# EAGLE board Protein (EAGLE 6.3), part 1 of 2
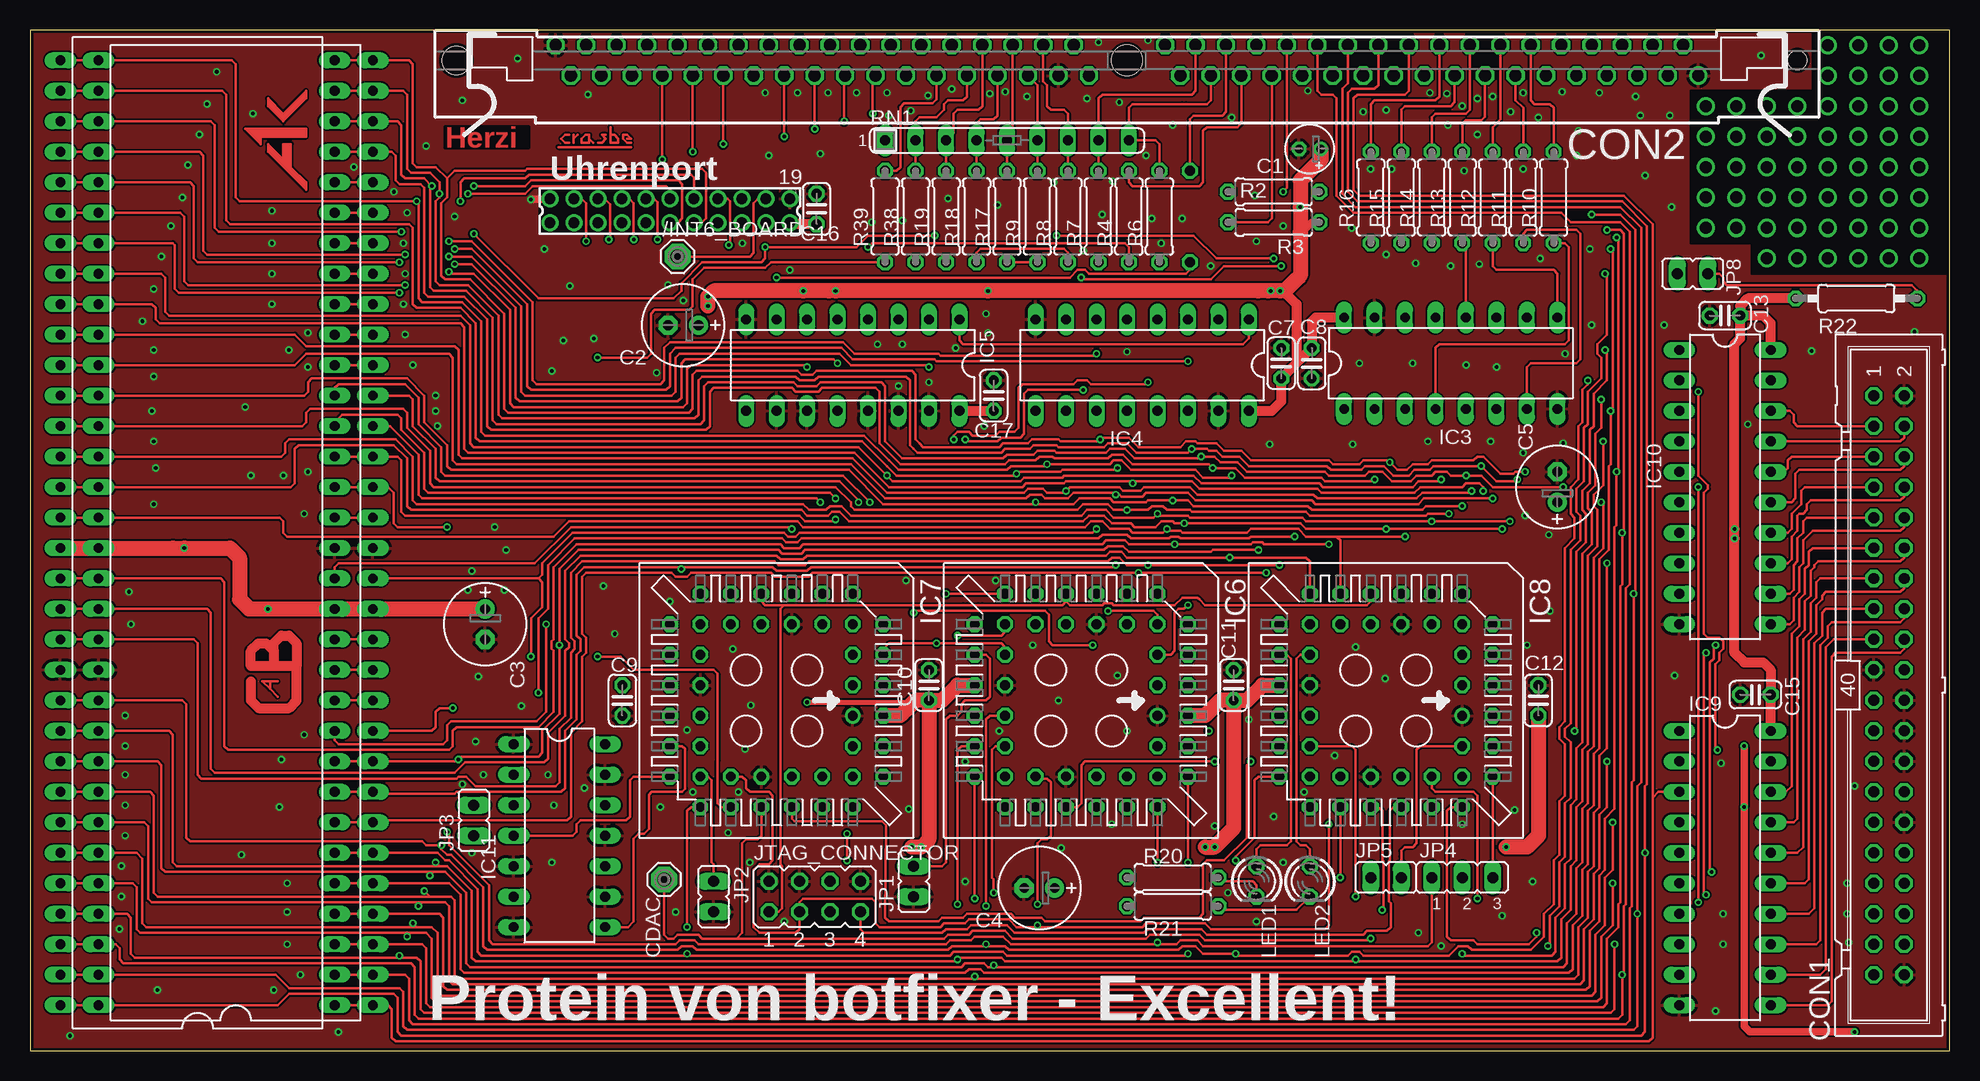
[diagram p6: board, top side]
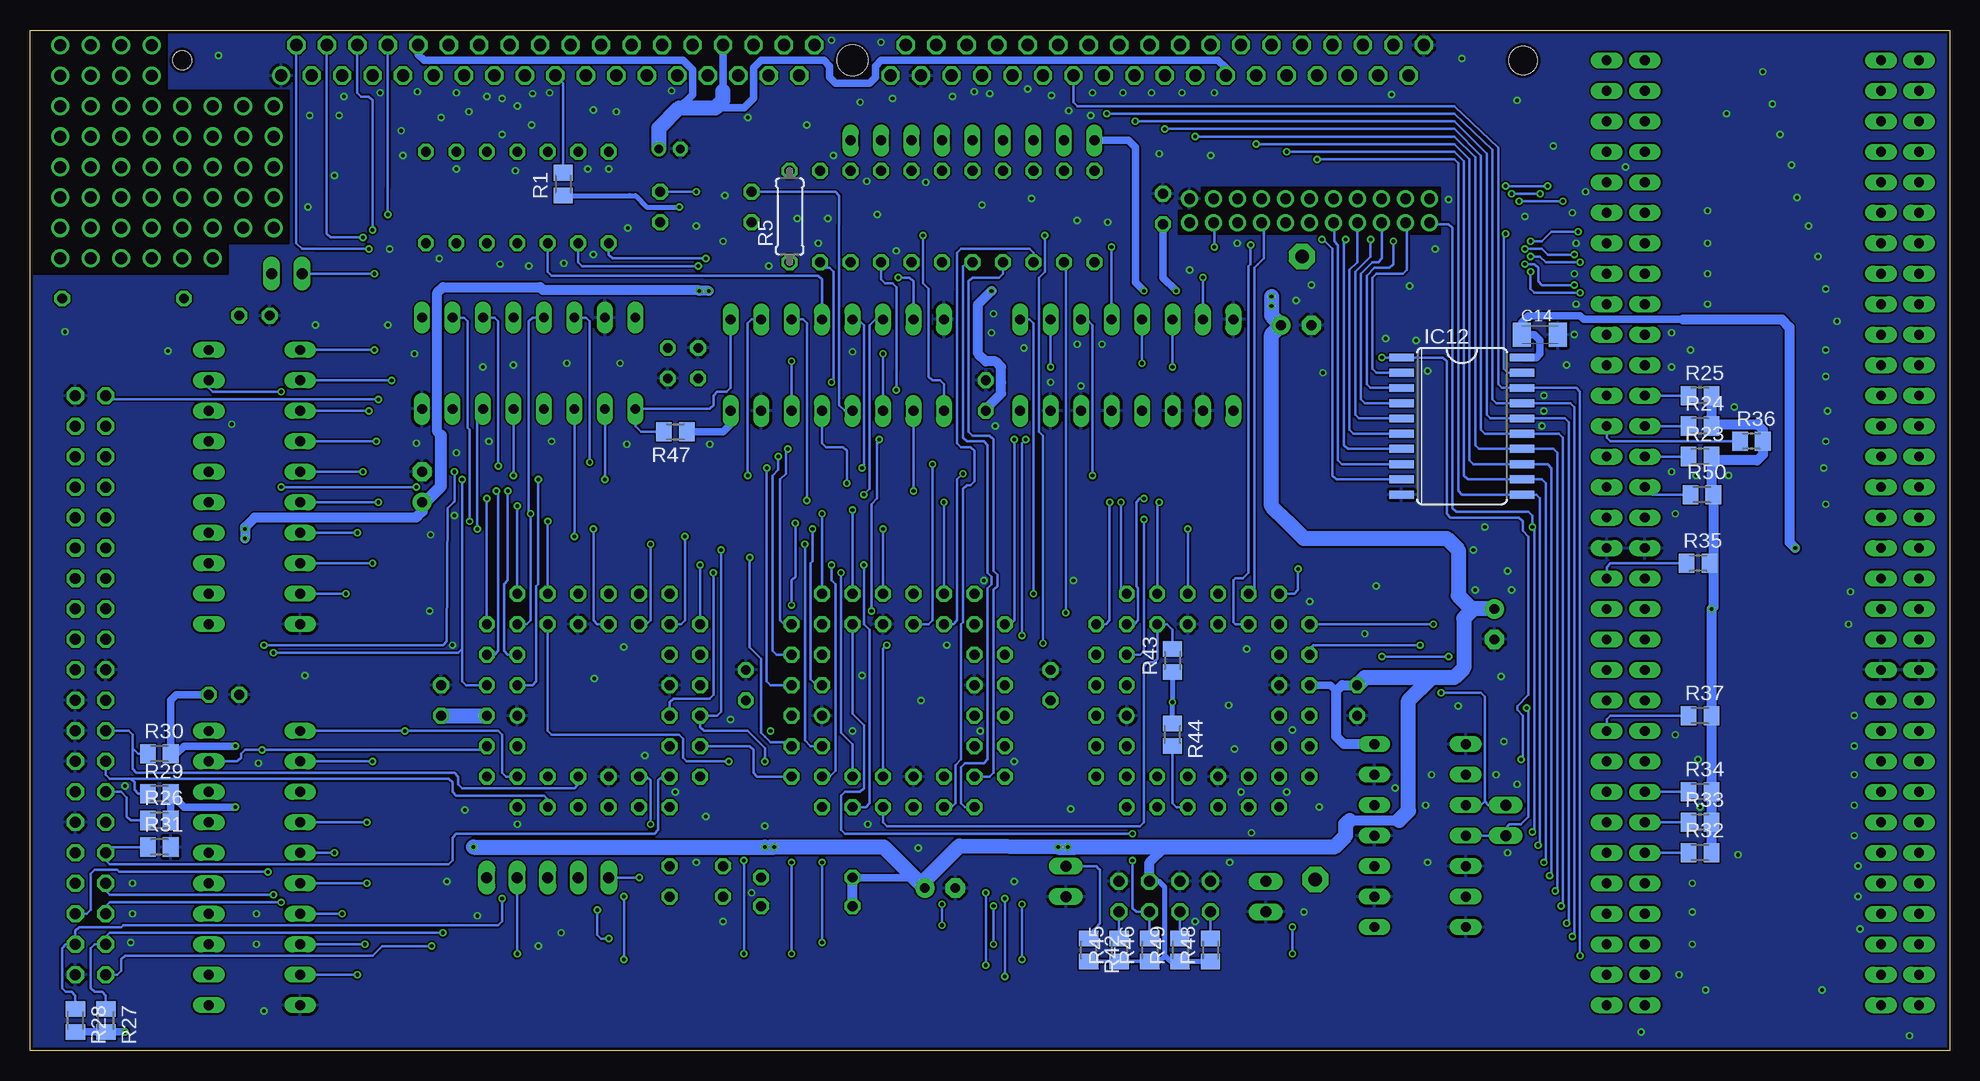
[diagram p7: board, bottom side, seen from below]

Size 160 x 85.08 mm. Coordinates in mm from the lower left corner, seen from the top.
Outline: 0,0 160,0 160,85.08 0,85.08 0,0
Copper layers (1*16): Top 0.035mm / dielectric 1.5mm / Bottom 0.035mm
Design rules "Fusion_eagle_rule_v1.1": minimum track width 6mil, minimum drill 12mil, track to track 6mil, track to pad 6mil, pad to pad 6mil, via to via 6mil, smd to smd 0mil, copper to edge 10mil, drill to drill 10mil, minimum pad ring 10mil, minimum via ring 6mil, stop-mask expansion 2mil, vias tented up to drill 100mil, thermal gap 10mil

## Footprints (pad centres in the part's own frame; a part is rotated, then mirrored left to right if it is on the bottom)
SE11 = drill 1.118 pad 2.159 octagon: MP 0,0
E1,8-4 = drill 0.711 pad 1.168: + -0.889,0 | drill 0.711 pad 1.168 octagon: - 0.889,0
E2,5-7 = drill 0.813 pad 1.6: + -1.27,0 | drill 0.813 pad 1.6 octagon: - 1.27,0
C025-024X044 = drill 0.813 octagon: 1 -1.27,0; 2 1.27,0
C1206K = smd 1.5 x 2: 1 -1.5,0; 2 1.5,0
ML40 = drill 0.914 octagon: 1 -24.13,-1.27; 2 -24.13,1.27; 3 -21.59,-1.27; 4 -21.59,1.27; 5 -19.05,-1.27; 6 -19.05,1.27; 7 -16.51,-1.27; 8 -16.51,1.27; 9 -13.97,-1.27; 10 -13.97,1.27; 11 -11.43,-1.27; 12 -11.43,1.27; 13 -8.89,-1.27; 14 -8.89,1.27; 15 -6.35,-1.27; 16 -6.35,1.27; 17 -3.81,-1.27; 18 -3.81,1.27; 19 -1.27,-1.27; 20 -1.27,1.27; 21 1.27,-1.27; 22 1.27,1.27; 23 3.81,-1.27; 24 3.81,1.27; 25 6.35,-1.27; 26 6.35,1.27; 27 8.89,-1.27; 28 8.89,1.27; 29 11.43,-1.27; 30 11.43,1.27; 31 13.97,-1.27; 32 13.97,1.27; 33 16.51,-1.27; 34 16.51,1.27; 35 19.05,-1.27; 36 19.05,1.27; 37 21.59,-1.27; 38 21.59,1.27; 39 24.13,-1.27; 40 24.13,1.27
73826962 = drill 1.016: 1 47.625,-1.27 | drill 1.016 octagon: 2 46.355,1.27; 3 45.085,-1.27; 4 43.815,1.27; 5 42.545,-1.27; 6 41.275,1.27; 7 40.005,-1.27; 8 38.735,1.27; 9 37.465,-1.27; 10 36.195,1.27; 11 34.925,-1.27; 12 33.655,1.27; 13 32.385,-1.27; 14 31.115,1.27; 15 29.845,-1.27; 16 28.575,1.27; 17 27.305,-1.27; 18 26.035,1.27; 19 24.765,-1.27; 20 23.495,1.27; 21 22.225,-1.27; 22 20.955,1.27; 23 19.685,-1.27; 24 18.415,1.27; 25 17.145,-1.27; 26 15.875,1.27; 27 14.605,-1.27; 28 13.335,1.27; 29 12.065,-1.27; 30 10.795,1.27; 31 9.525,-1.27; 32 8.255,1.27; 33 6.985,-1.27; 34 5.715,1.27; 35 4.445,-1.27; 36 3.175,1.27; 37 -3.175,-1.27; 38 -4.445,1.27; 39 -5.715,-1.27; 40 -6.985,1.27; 41 -8.255,-1.27; 42 -9.525,1.27; 43 -10.795,-1.27; 44 -12.065,1.27; 45 -13.335,-1.27; 46 -14.605,1.27; 47 -15.875,-1.27; 48 -17.145,1.27; 49 -18.415,-1.27; 50 -19.685,1.27; 51 -20.955,-1.27; 52 -22.225,1.27; 53 -23.495,-1.27; 54 -24.765,1.27; 55 -26.035,-1.27; 56 -27.305,1.27; 57 -28.575,-1.27; 58 -29.845,1.27; 59 -31.115,-1.27; 60 -32.385,1.27; 61 -33.655,-1.27; 62 -34.925,1.27; 63 -36.195,-1.27; 64 -37.465,1.27; 65 -38.735,-1.27; 66 -40.005,1.27; 67 -41.275,-1.27; 68 -42.545,1.27; 69 -43.815,-1.27; 70 -45.085,1.27; 71 -46.355,-1.27; 72 -47.625,1.27 | hole 2.362: -55.88,0 | hole 1.575: 55.88,0 | hole 2.54: 0,0
DIL64 = drill 0.813 long: 1 -39.37,-11.43; 2 -36.83,-11.43; 3 -34.29,-11.43; 4 -31.75,-11.43; 5 -29.21,-11.43; 6 -26.67,-11.43; 7 -24.13,-11.43; 8 -21.59,-11.43; 9 -19.05,-11.43; 10 -16.51,-11.43; 11 -13.97,-11.43; 12 -11.43,-11.43; 13 -8.89,-11.43; 14 -6.35,-11.43; 15 -3.81,-11.43; 16 -1.27,-11.43; 17 1.27,-11.43; 18 3.81,-11.43; 19 6.35,-11.43; 20 8.89,-11.43; 21 11.43,-11.43; 22 13.97,-11.43; 23 16.51,-11.43; 24 19.05,-11.43; 25 21.59,-11.43; 26 24.13,-11.43; 27 26.67,-11.43; 28 29.21,-11.43; 29 31.75,-11.43; 30 34.29,-11.43; 31 36.83,-11.43; 32 39.37,-11.43; 33 39.37,11.43; 34 36.83,11.43; 35 34.29,11.43; 36 31.75,11.43; 37 29.21,11.43; 38 26.67,11.43; 39 24.13,11.43; 40 21.59,11.43; 41 19.05,11.43; 42 16.51,11.43; 43 13.97,11.43; 44 11.43,11.43; 45 8.89,11.43; 46 6.35,11.43; 47 3.81,11.43; 48 1.27,11.43; 49 -1.27,11.43; 50 -3.81,11.43; 51 -6.35,11.43; 52 -8.89,11.43; 53 -11.43,11.43; 54 -13.97,11.43; 55 -16.51,11.43; 56 -19.05,11.43; 57 -21.59,11.43; 58 -24.13,11.43; 59 -26.67,11.43; 60 -29.21,11.43; 61 -31.75,11.43; 62 -34.29,11.43; 63 -36.83,11.43; 64 -39.37,11.43
DIL16 = drill 0.813 long: 1 -8.89,-3.81; 2 -6.35,-3.81; 3 -3.81,-3.81; 4 -1.27,-3.81; 5 1.27,-3.81; 6 3.81,-3.81; 7 6.35,-3.81; 8 8.89,-3.81; 9 8.89,3.81; 10 6.35,3.81; 11 3.81,3.81; 12 1.27,3.81; 13 -1.27,3.81; 14 -3.81,3.81; 15 -6.35,3.81; 16 -8.89,3.81
PLCC-S44 = drill 0.813: 1 1.27,6.35 | drill 0.813 octagon: 2 -1.27,8.89; 3 -1.27,6.35; 4 -3.81,8.89; 5 -3.81,6.35; 6 -6.35,8.89; 7 -8.89,6.35; 8 -6.35,6.35; 9 -8.89,3.81; 10 -6.35,3.81; 11 -8.89,1.27; 12 -6.35,1.27; 13 -8.89,-1.27; 14 -6.35,-1.27; 15 -8.89,-3.81; 16 -6.35,-3.81; 17 -8.89,-6.35; 18 -6.35,-8.89; 19 -6.35,-6.35; 20 -3.81,-8.89; 21 -3.81,-6.35; 22 -1.27,-8.89; 23 -1.27,-6.35; 24 1.27,-8.89; 25 1.27,-6.35; 26 3.81,-8.89; 27 3.81,-6.35; 28 6.35,-8.89; 29 8.89,-6.35; 30 6.35,-6.35; 31 8.89,-3.81; 32 6.35,-3.81; 33 8.89,-1.27; 34 6.35,-1.27; 35 8.89,1.27; 36 6.35,1.27; 37 8.89,3.81; 38 6.35,3.81; 39 8.89,6.35; 40 6.35,8.89; 41 6.35,6.35; 42 3.81,8.89; 43 3.81,6.35; 44 1.27,8.89
DIL20 = drill 0.813 long: 1 -11.43,-3.81; 2 -8.89,-3.81; 3 -6.35,-3.81; 4 -3.81,-3.81; 5 -1.27,-3.81; 6 1.27,-3.81; 7 3.81,-3.81; 8 6.35,-3.81; 9 8.89,-3.81; 10 11.43,-3.81; 11 11.43,3.81; 12 8.89,3.81; 13 6.35,3.81; 14 3.81,3.81; 15 1.27,3.81; 16 -1.27,3.81; 17 -3.81,3.81; 18 -6.35,3.81; 19 -8.89,3.81; 20 -11.43,3.81
DIL14 = drill 0.813 long: 1 -7.62,-3.81; 2 -5.08,-3.81; 3 -2.54,-3.81; 4 0,-3.81; 5 2.54,-3.81; 6 5.08,-3.81; 7 7.62,-3.81; 8 7.62,3.81; 9 5.08,3.81; 10 2.54,3.81; 11 0,3.81; 12 -2.54,3.81; 13 -5.08,3.81; 14 -7.62,3.81
SO20W = smd 0.66 x 2.032: 1 -5.715,-5.029; 2 -4.445,-5.029; 3 -3.175,-5.029; 4 -1.905,-5.029; 5 -0.635,-5.029; 6 0.635,-5.029; 7 1.905,-5.029; 8 3.175,-5.029; 9 4.445,-5.029; 10 5.715,-5.029; 11 5.715,5.029; 12 4.445,5.029; 13 3.175,5.029; 14 1.905,5.029; 15 0.635,5.029; 16 -0.635,5.029; 17 -1.905,5.029; 18 -3.175,5.029; 19 -4.445,5.029; 20 -5.715,5.029
JP1 = drill 0.914 long: 1 0,-1.27; 2 0,1.27
JP2 = drill 0.914 long: 1 -2.54,0; 2 0,0; 3 2.54,0
JP4Q = drill 0.914 octagon: 1 -3.81,-1.27; 2 -3.81,1.27; 3 -1.27,-1.27; 4 -1.27,1.27; 5 1.27,-1.27; 6 1.27,1.27; 7 3.81,-1.27; 8 3.81,1.27
LED3MM = drill 0.813 octagon: A -1.27,0; K 1.27,0
M0805 = smd 1.3 x 1.6: 1 -0.95,0; 2 0.95,0
0207/7 = drill 0.813 octagon: 1 -3.81,0; 2 3.81,0
0207/10 = drill 0.813 octagon: 1 -5.08,0; 2 5.08,0
SIL9 = drill 0.813 long: 1 -10.16,0; 2 -7.62,0; 3 -5.08,0; 4 -2.54,0; 5 0,0; 6 2.54,0; 7 5.08,0; 8 7.62,0; 9 10.16,0
BREAD = drill 1: P$1 0,0; P$2 0,2.54
87758-2216 = drill 0.9 pad 1.27: 1 -10,-1; 2 -10,1; 3 -8,-1; 4 -8,1; 5 -6,-1; 6 -6,1; 7 -4,-1; 8 -4,1; 9 -2,-1; 10 -2,1; 11 0,-1; 12 0,1; 13 2,-1; 14 2,1; 15 4,-1; 16 4,1; 17 6,-1; 18 6,1; 19 8,-1; 20 8,1; 21 10,-1; 22 10,1

## Placement (x,y rotation side)
/INT6_BOARD  SE11  [SE11]  53.98,66.2 0 top
C1  [E1,8-4]  106.68,75.17 180 top
C2  [E2,5-7]  54.45,60.48 180 top
C3  [E2,5-7]  37.94,35.56 270 top
C4  [E2,5-7]  84.14,13.57 180 top
C5  [E2,5-7]  127.32,46.99 90 top
C7  100n  [C025-024X044]  104.3,57.31 90 top
C8  100n  [C025-024X044]  106.84,57.31 270 top
C9  100n  [C025-024X044]  49.37,29.21 270 top
C10  100n  [C025-024X044]  74.93,30.48 90 top
C11  100n  [C025-024X044]  100.33,30.48 90 top
C12  100n  [C025-024X044]  125.73,29.21 90 top
C13  100n  [C025-024X044]  141.29,61.28 180 top
C14  100n  [C1206K]  34.13,59.69 0 bottom
C15  100n  [C025-024X044]  143.83,29.69 0 top
C16  100n  [C025-024X044]  65.56,70.17 90 top
C17  100n  [C025-024X044]  80.33,54.61 90 top
CDAC_BOARD  SE11  [SE11]  52.86,14.29 180 top
CON1  [ML40]  154.94,30.48 270 top
CON2  [73826962]  91.44,82.55 0 top
IC1  [DIL64]  17.14,43.18 90 top
IC2  [DIL64]  13.97,43.18 90 top
IC3  74157N  [DIL16]  118.43,57.31 0 top
IC4  74157N  [DIL16]  92.71,57.15 180 top
IC5  74157N  [DIL16]  68.58,57.15 180 top
IC6  M4A5_64/32  [PLCC-S44]  87.63,29.21 270 top
IC7  M4A5_64/32  [PLCC-S44]  62.23,29.21 270 top
IC8  M4A5_64/32  [PLCC-S44]  113.03,29.21 270 top
IC9  74LS245N  [DIL20]  141.29,15.24 270 top
IC10  74LS245N  [DIL20]  141.29,46.99 270 top
IC11  7407  [DIL14]  44.13,17.94 270 top
IC12  74LS245DW  [SO20W]  40.64,52.07 270 bottom
JP1  [JP1]  73.66,14.13 0 top
JP2  [JP1]  56.99,12.86 180 top
JP3  [JP1]  36.99,19.21 0 top
JP4  [JP2]  119.38,14.45 0 top
JP5  [JP1]  113.03,14.45 270 top
JP8  [JP1]  138.59,64.77 90 top
JTAG_CONNECTOR  [JP4Q]  65.41,12.86 0 top
LED1  [LED3MM]  102.23,14.13 270 top
LED2  [LED3MM]  106.68,14.13 270 top
R1  [M0805]  115.57,72.23 90 bottom
R2  [0207/7]  103.66,71.6 0 top
R3  [0207/7]  103.66,69.06 180 top
R4  [0207/7]  91.6,69.53 90 top
R5  [0207/7]  96.68,69.53 90 bottom
R6  [0207/7]  94.14,69.53 90 top
R7  [0207/7]  89.06,69.53 90 top
R8  [0207/7]  86.52,69.53 90 top
R9  [0207/7]  83.98,69.53 90 top
R10  [0207/7]  127,71.12 90 top
R11  [0207/7]  124.46,71.12 90 top
R12  [0207/7]  121.92,71.12 90 top
R13  [0207/7]  119.38,71.12 90 top
R14  [0207/7]  116.84,71.12 90 top
R15  [0207/7]  114.3,71.12 90 top
R16  [0207/7]  111.76,71.12 90 top
R17  [0207/7]  81.44,69.53 90 top
R18  [0207/7]  78.9,69.53 90 top
R19  [0207/7]  76.36,69.53 90 top
R20  470R  [0207/7]  95.25,14.45 180 top
R21  470R  [0207/7]  95.25,12.06 180 top
R22  4K7  [0207/10]  152.24,62.71 0 top
R23  [M0805]  20.8,49.53 0 bottom
R24  [M0805]  20.8,52.07 0 bottom
R25  [M0805]  20.8,54.61 0 bottom
R26  [M0805]  149.22,19.21 0 bottom
R27  [M0805]  153.67,2.54 270 bottom
R28  [M0805]  156.21,2.54 270 bottom
R29  [M0805]  149.22,21.43 0 bottom
R30  [M0805]  149.22,24.77 0 bottom
R31  [M0805]  149.22,16.99 0 bottom
R32  [M0805]  20.8,16.51 0 bottom
R33  [M0805]  20.8,19.05 0 bottom
R34  [M0805]  20.8,21.59 0 bottom
R35  [M0805]  20.95,40.64 0 bottom
R36  [M0805]  16.51,50.8 0 bottom
R37  [M0805]  20.8,27.94 0 bottom
R38  [0207/7]  73.82,69.53 90 top
R39  [0207/7]  71.28,69.53 90 top
R42  [M0805]  71.75,8.41 270 bottom
R43  [M0805]  64.77,32.54 90 bottom
R44  [M0805]  64.77,26.35 270 bottom
R45  [M0805]  69.22,8.41 90 bottom
R46  [M0805]  66.67,8.41 90 bottom
R47  [M0805]  106.2,51.59 180 bottom
R48  [M0805]  61.59,8.41 90 bottom
R49  [M0805]  64.14,8.41 90 bottom
R50  [M0805]  20.64,46.35 0 bottom
RN1  [SIL9]  81.44,75.88 0 top
U$1  A1K  [A1K]  21.11,76.2 90 top
U$2  CRASBE  [CRASBE]  47.15,76.2 0 top
U$3  CAB  [CAB-LOGO]  20,31.43 90 top
U$4  BREAD_2  [BREAD]  157.48,81.28 0 top
U$5  BREAD_2  [BREAD]  152.4,76.2 0 top
U$6  BREAD_2  [BREAD]  152.4,81.28 0 top
U$7  BREAD_2  [BREAD]  149.86,81.28 0 top
U$8  BREAD_2  [BREAD]  154.94,76.2 0 top
U$9  BREAD_2  [BREAD]  154.94,71.12 0 top
U$10  BREAD_2  [BREAD]  157.48,71.12 0 top
U$11  BREAD_2  [BREAD]  157.48,76.2 0 top
U$12  BREAD_2  [BREAD]  154.94,81.28 0 top
U$13  BREAD_2  [BREAD]  152.4,71.12 0 top
U$14  BREAD_2  [BREAD]  149.86,76.2 0 top
U$15  BREAD_2  [BREAD]  147.32,76.2 0 top
U$16  BREAD_2  [BREAD]  139.7,71.12 0 top
U$17  BREAD_2  [BREAD]  144.78,76.2 0 top
U$18  BREAD_2  [BREAD]  149.86,71.12 0 top
U$19  BREAD_2  [BREAD]  144.78,71.12 0 top
U$20  BREAD_2  [BREAD]  147.32,71.12 0 top
U$21  BREAD_2  [BREAD]  142.24,71.12 0 top
U$22  BREAD_2  [BREAD]  152.4,68.58 90 top
U$23  BREAD_2  [BREAD]  147.32,66.04 90 top
U$24  BREAD_2  [BREAD]  147.32,68.58 90 top
U$25  BREAD_2  [BREAD]  152.4,66.04 90 top
U$26  BREAD_2  [BREAD]  157.48,66.04 90 top
U$27  BREAD_2  [BREAD]  142.24,76.2 0 top
U$28  BREAD_2  [BREAD]  139.7,76.2 0 top
U$29  BREAD_2  [BREAD]  157.48,68.58 90 top
U$30  BREAD_2  [BREAD]  142.24,68.58 90 top
X1  87758-2216  [87758-2216]  53.34,70.01 180 top

## Tracks (layer width: path | path; a pad name or v marks a point on that pad's centre or on a via)
+5V  (via drill 0.3)
  Top 0.406: v64.77,29.05 65.09,29.05 74.77,29.05 C10.1 | v105.89,70.33 105.89,68.26
  Top 0.61: v67.15,63.34 66.6,63.34 | v142.88,25.4 v142.88,20.32 142.88,2.06 143.35,1.59 v152.08,1.59 | R3.1 106.84,69.06 105.89,68.1
  Top 0.813: IC9.20 C15.2 145.1,31.75 144.46,32.38 142.88,32.38 142.08,33.18 v142.08,42.7 v142.08,43.5 142.08,58.9 142.56,59.37 C13.1 | IC10.20 145.1,60.64 144.46,61.28 C13.1 | IC4.16 103.5,53.34 104.3,54.13 C7.1 105.33,57.07 | IC3.16 107.16,61.12 106.84,60.8 C8.1 105.33,57.07 | R22.1 143.19,62.71 142.56,62.07 C13.1 | IC5.16 C17.1 | C16.1 63.45,68.9 X1.2 | v12.86,41.91 11.91,41.91 | 103.19,63.34 v104.22,63.34 104.46,63.34 105.41,62.39 105.57,62.23 105.57,57.31 105.33,57.07 | v19.84,36.83 21.51,36.83
  Top 1.27: IC2.49 IC1.49 11.91,41.91 v12.86,41.91 16.67,41.91 17.46,41.12 17.46,37.62 18.26,36.83 v19.84,36.83 21.51,36.83 IC2.14 | IC2.14 | IC2.14 IC1.14 C3.+ | C12.1 125.73,17.94 124.78,16.99 v123.03,16.99 | C11.1 100.33,18.57 v98.74,16.99 v97.95,16.99 | C10.1 74.93,17.62 v74.3,16.99 v73.5,16.99 | C10.1 73.82,29.21 73.03,28.42 72.55,27.94 IC7.44 | C10.1 76.04,29.21 77.31,30.48 IC6.22 | C11.1 99.22,29.21 97.95,27.94 IC6.44 | C11.1 101.44,29.21 102.71,30.48 IC8.22 | v56.52,62.07 v56.52,62.87 56.99,63.34 v64.45,63.34 66.6,63.34 v67.15,63.34 v79.85,63.34 102.39,63.34 103.19,63.34 v104.22,63.34 104.62,63.34 105.57,64.29 105.89,64.61 105.89,68.1 105.89,68.26 v105.89,70.33 105.89,72.55 107.63,74.3 107.63,74.61 107.63,75.11 C1.+
  Bottom 0.305: R42.2 R45.1 R46.1
  Bottom 0.406: R46.1 65.88,7.46 65.41,7.93 65.41,7.94 | 65.41,7.94 65.41,10.95 65.41,13.65 65.88,14.13 JTAG_CONNECTOR.6 | 65.41,7.94 64.93,7.46 R49.1 R48.1 | R43.1 v64.77,29.05 R44.1 | R1.1 110.02,71.28 109.54,71.28 108.58,70.33 v105.89,70.33
  Bottom 0.61: IC12.20 34.45,57.78 34.13,58.1 34.13,59.21 34.61,59.69 C14.1 35.63,60.73 35.08,61.28 30.8,61.28 30.48,60.96 22.23,60.96 | R47.1 102.23,51.59 101.6,52.23 IC4.16 | CON2.10 127.64,83.03 127.16,82.55 105.73,82.55 105.57,82.55 104.78,81.76 104.78,79.69 105.89,78.58 | CON2.59 60.33,81.92 60.96,82.55 89.06,82.55 89.53,82.07 89.53,81.76 89.53,81.12 90.01,80.64 90.17,80.64 92.87,80.64 93.34,81.12 93.34,82.07 93.82,82.55 98.42,82.55 99.06,82.55 99.69,81.92 99.69,79.38 100.49,78.58 104.14,78.58 | C16.1 65.56,64.45 v64.45,63.34 | IC7.22 51.59,30.48 51.12,30 | CON2.30 102.23,80.01 | R20.2 86.84,14.45 86.56,14.72 | v67.15,63.34 67.87,64.06 67.87,75.33 68.42,75.88 RN1.1 | R26.2 R29.2 147.16,20.32 v142.88,20.32 | v142.88,25.4 147.16,25.4 147.8,24.77 R30.2 148.28,29.21 147.8,29.69 C15.2 | R28.2 R27.2 v152.09,1.59 v152.08,1.59
  Bottom 0.813: IC11.14 50.48,25.56 51.12,26.19 51.12,30 50.64,30.48 C9.1 | C5.+ 127.32,45.01 127.79,44.45 141.29,44.45 142.08,43.66 v142.08,43.5 v142.08,42.7 | 50.01,19.21 45.88,19.21 | JTAG_CONNECTOR.6 66.67,15.72 65.41,16.99 | R21.2 R20.2 | v79.85,63.34 80.96,62.23 80.96,58.1 80.33,57.47 79.53,57.47 79.06,56.99 79.06,55.72 79.06,54.77 80.33,53.5 C17.1 | 22.23,60.96 13.97,60.96 13.34,60.33 13.34,42.39 v12.86,41.91 | v103.43,63.34 v104.22,63.34 104.3,63.42 117.24,63.42 117.47,63.66 125.57,63.66 126.05,63.18 126.05,51.59 125.73,51.28 | v19.85,36.83 v19.84,36.83 | R25.2 R24.2 19.53,52.07 19.37,52.23 16.03,52.23 15.56,51.75 R36.2 15.56,49.69 16.03,49.21 19.53,49.21 R23.2 19.85,46.51 R50.2 19.69,42.55 19.68,42.55 19.68,40.96 | R32.2 R33.2 R34.2 R37.2 v19.84,36.83 | 19.68,40.96 R35.2 | 19.68,40.96 19.68,36.99 v19.84,36.83
  Bottom 1.016: 127.32,45.01 127.32,45.48 125.73,47.07 125.73,51.28
  Bottom 1.27: C3.+ 39.69,36.83 39.77,36.75 | 39.77,36.75 40.48,36.04 40.48,31.91 41.27,31.11 43.18,31.11 | 43.18,31.11 48.74,31.11 C9.1 | C12.1 IC8.44 | v123.03,16.99 v98.74,16.99 | v98.74,16.99 98.27,16.99 | 98.27,16.99 v97.95,16.99 88.9,16.99 88.82,16.99 86.56,14.72 C4.+ 85.41,14.21 82.55,17.07 v74.3,16.99 | 50.01,19.21 50.32,18.89 50.32,17.94 51.28,16.99 65.41,16.99 72.87,16.99 | 45.88,19.21 45.09,20 45.09,29.21 43.18,31.11 | v98.74,16.99 98.27,16.99 | 72.87,16.99 v73.5,16.99 | v73.5,16.99 v74.3,16.99 | v74.3,16.99 v73.5,16.99 | v73.5,16.99 72.87,16.99 | v56.52,62.87 v56.52,62.07 56.52,61.28 C2.+ 56.52,59.69 56.52,45.4 55.24,44.13 53.82,42.7 41.91,42.7 40.96,41.75 40.96,37.94 39.77,36.75 | 102.23,80.01 102.23,79.22 102.87,78.58 104.14,78.58 105.89,78.58 107.57,76.9 C1.+
A1  (via drill 0.3)
  Top 0.203: IC2.29 IC1.29 30.16,74.93 30.48,74.61 30.48,72.55 30.8,72.23 32.54,72.23 32.86,71.91 32.86,63.18 33.18,62.87 36.2,62.87 38.1,60.96 38.1,52.07 38.42,51.75 56.36,51.75 56.67,52.07 56.67,54.93 56.99,55.24 63.5,55.24 63.82,54.93 65.72,54.93 66.04,55.24 70.48,55.24 70.8,54.93 70.8,50.64 72.55,48.9 81.28,48.9 81.6,49.21 83.82,49.21 84.14,49.53 85.25,49.53 85.41,49.37 89.85,49.37 90.17,49.69 91.12,49.69 91.92,48.9 98.27,48.9 v98.58,48.58 100.49,48.58 101.28,47.78 107.63,47.78 107.95,47.47 111.92,47.47 v112.08,47.62
  Bottom 0.203: v98.58,48.58 98.58,30.8 98.27,30.48 IC6.2 | v112.08,47.62 IC3.2
A2  (via drill 0.3)
  Top 0.203: IC2.30 IC1.30 30.64,77.47 30.96,77.15 30.96,73.03 31.27,72.71 32.86,72.71 v33.5,72.07 33.34,71.91 33.34,63.66 33.66,63.34 36.35,63.34 38.58,61.12 38.58,52.55 38.89,52.23 55.88,52.23 56.2,52.55 56.2,55.4 56.52,55.72 63.66,55.72 63.98,55.4 65.56,55.4 65.88,55.72 70.96,55.72 71.28,55.4 71.28,50.8 72.71,49.37 81.12,49.37 81.44,49.69 83.66,49.69 83.98,50.01 85.41,50.01 85.57,49.85 89.69,49.85 90.01,50.16 91.28,50.16 92.08,49.37 97.47,49.37 v97.63,49.53 98.74,49.53 99.22,49.05 100.65,49.05 101.44,48.26 107.95,48.26 108.27,47.94 111.28,47.94 111.6,48.26 112.71,48.26 113.51,47.47 115.09,47.47 115.57,47.94 116.84,47.94 117.16,48.26 118.11,48.26 118.43,47.94 v119.7,47.94 120.97,47.94 121.92,46.99 v127.79,46.99 | v139.06,46.99 v139.06,12.38 | v36.99,72.07 41.27,72.07 41.75,72.55 54.05,72.55 54.37,72.23 54.37,69.37 54.05,69.06 53.39,69.06 X1.12
  Bottom 0.203: v97.63,49.53 97.63,48.42 98.11,47.94 98.11,33.34 97.79,33.02 IC6.4 | IC3.5 v119.7,47.94 | v127.79,46.99 v139.06,46.99 | v139.06,12.38 153.35,12.38 153.67,12.06 CON1.35 | v36.99,72.07 v33.5,72.07
A3  (via drill 0.3)
  Top 0.203: IC2.31 IC1.31 31.11,80.01 31.43,79.69 31.43,73.5 31.75,73.18 33.34,73.18 34.13,72.39 v34.13,71.44 34.13,71.12 33.81,70.8 33.81,64.14 34.13,63.82 36.51,63.82 39.05,61.28 39.05,53.02 39.37,52.7 55.4,52.7 55.72,53.02 55.72,55.88 56.04,56.2 63.82,56.2 64.14,55.88 65.41,55.88 65.72,56.2 73.03,56.2 73.34,55.88 73.34,50.48 73.66,50.16 73.98,49.85 80.96,49.85 81.28,50.16 83.34,50.16 83.66,50.48 85.57,50.48 85.72,50.32 89.53,50.32 89.85,50.64 91.44,50.64 92.23,49.85 96.52,49.85 v96.84,50.16 98.11,50.16 98.27,50.01 98.9,50.01 99.38,49.53 100.81,49.53 101.6,48.74 108.11,48.74 108.43,48.42 110.97,48.42 111.28,48.74 112.87,48.74 113.67,47.94 114.94,47.94 115.41,48.42 116.68,48.42 117,48.74 v120.97,48.74 122.24,47.47 123.83,47.47 v123.98,47.62 | v139.7,13.02 139.54,13.18 139.54,33.02 v139.7,33.18 | v36.51,71.44 41.27,71.44 41.91,72.07 53.02,72.07 53.34,71.75 X1.11
  Bottom 0.203: v123.98,47.62 123.98,33.5 | 123.98,33.5 123.98,30.8 123.67,30.48 IC8.2 | v120.97,48.74 120.97,60.8 121.28,61.12 IC3.11 | IC6.6 97.16,35.56 97.47,35.88 97.47,47.62 97,48.1 97,50.01 v96.84,50.16 | CON1.33 153.67,13.34 153.35,13.02 v139.7,13.02 | v139.7,33.18 124.3,33.18 123.98,33.5 | v36.51,71.44 v34.13,71.44
A4  (via drill 0.3)
  Top 0.203: IC2.32 IC1.32 31.59,82.55 31.91,82.23 31.91,73.98 32.23,73.66 33.81,73.66 34.77,72.71 | IC6.8 93.98,36.35 93.66,36.67 v89.85,36.67 | v140.49,33.81 140.34,33.66 140.34,32.7 140.02,32.38 140.02,15.08 v140.18,14.92 | 34.77,72.71 34.77,71.12 34.29,70.64 34.29,64.61 34.61,64.29 36.67,64.29 39.53,61.44 39.53,53.5 39.85,53.18 54.93,53.18 55.24,53.5 55.24,56.36 55.56,56.67 63.98,56.67 64.29,56.36 65.25,56.36 65.56,56.67 73.5,56.67 73.82,56.36 73.82,50.96 74.14,50.64 74.45,50.32 80.8,50.32 81.12,50.64 83.19,50.64 83.5,50.96 85.72,50.96 85.88,50.8 89.06,50.8 v89.22,50.96 89.38,51.12 91.6,51.12 92.39,50.32 95.89,50.32 96.36,50.8 97.16,50.8 97.31,50.64 98.9,50.64 99.54,50.01 100.97,50.01 101.76,49.21 108.27,49.21 108.58,48.9 110.81,48.9 111.12,49.21 113.19,49.21 v113.35,49.05 113.98,48.42 114.78,48.42 115.25,48.9 116.52,48.9 116.84,49.21 120.33,49.21 120.65,49.53 121.13,49.53 122.56,48.1 123.67,48.1 123.83,48.26 v124.62,48.26 | 34.77,72.71 35.4,73.34 41.27,73.34 41.43,73.5 56.04,73.5 56.36,73.18 56.36,69.37 56.04,69.06 55.39,69.06 X1.10
  Bottom 0.203: v89.85,36.67 89.85,45.56 89.38,46.04 89.38,50.8 v89.22,50.96 | IC3.14 113.67,61.12 113.35,60.8 113.35,50.01 v113.35,49.05 | v140.49,33.81 125.57,33.81 125.25,34.13 125.17,45.24 124.7,45.72 124.62,45.8 v124.62,48.26 | v140.18,14.92 152.56,14.92 152.72,15.08 154.62,15.08 154.94,14.76 154.94,11.75 155.26,11.43 CON1.36
A5  (via drill 0.3)
  Top 0.203: IC2.33 IC1.33 16.83,82.55 17.14,82.23 17.14,71.12 17.46,70.8 v32.23,70.8 32.38,70.64 32.38,62.71 32.7,62.39 36.04,62.39 37.62,60.8 37.62,51.59 37.94,51.28 69.53,51.28 71.6,49.21 72.39,48.42 81.44,48.42 81.76,48.74 84.61,48.74 v84.77,48.9 90.01,48.9 90.33,49.21 90.96,49.21 91.76,48.42 97.16,48.42 97.79,47.78 100.01,47.78 v100.17,47.94 | v35.88,70.8 35.88,72.39 36.2,72.71 41.27,72.71 41.59,73.03 55.09,73.03 55.34,72.77 X1.9
  Bottom 0.203: v84.77,48.9 84.77,35.88 85.09,35.56 IC6.14 | v100.17,47.94 100.17,60.64 99.85,60.96 IC4.2 | v35.88,70.8 v32.23,70.8
A6  (via drill 0.3)
  Top 0.203: IC2.34 IC1.34 16.03,80.01 16.35,79.69 16.35,69.22 16.67,68.9 31.59,68.9 31.91,68.58 31.91,62.23 32.23,61.91 35.88,61.91 37.15,60.64 37.15,51.12 37.47,50.8 69.37,50.8 71.44,48.74 72.23,47.94 82.07,47.94 v82.23,48.1 82.39,48.26 85.88,48.26 86.04,48.42 90.49,48.42 v90.65,48.58
  Bottom 0.203: v82.23,48.1 82.71,47.62 82.71,35.88 83.03,35.56 IC6.16 | v90.65,48.58 90.49,48.74 90.49,60.48 90.96,60.96 IC4.5
A7  (via drill 0.3)
  Top 0.203: IC2.35 IC1.35 15.08,77.47 15.4,77.15 15.4,68.58 15.72,68.26 v30.96,68.26 | v88.9,58.1 88.74,57.94 75.88,57.94 75.72,58.1 68.74,58.1 67.79,59.05 53.34,59.05 52.86,58.58 52.86,55.88 52.55,55.56 42.23,55.56 41.91,55.88 41.91,62.39 36.83,67.47 v34.92,67.47
  Bottom 0.203: v30.96,68.26 33.18,68.26 33.97,67.47 v34.92,67.47 | IC4.11 v88.9,58.1
A8  (via drill 0.3)
  Top 0.203: IC2.36 IC1.36 14.13,74.93 14.45,74.61 14.45,66.67 14.76,66.36 v31.27,66.36 | v35.4,66.83 36.83,66.83 41.43,62.23 41.43,55.4 41.75,55.09 53.02,55.09 53.34,55.4 53.34,58.1 53.82,58.58 67.63,58.58 68.58,57.63 75.41,57.63 75.56,57.47 v96.52,57.47
  Bottom 0.203: v31.27,66.36 33.5,66.36 33.97,66.83 v35.4,66.83 | v96.52,57.47 IC4.14
A9  (via drill 0.3)
  Top 0.203: IC2.37 IC1.37 13.34,72.39 13.65,72.07 13.65,66.04 13.97,65.72 v30.8,65.72 | v34.92,66.2 36.83,66.2 40.96,62.07 40.96,54.93 41.27,54.61 53.5,54.61 53.82,54.93 53.82,57.78 54.13,58.1 67.47,58.1 68.42,57.15 74.77,57.15 v74.93,56.99
  Bottom 0.203: v30.8,65.72 33.66,65.72 34.13,66.2 v34.92,66.2 | v74.93,56.99 IC5.2
A10  (via drill 0.3)
  Top 0.203: IC2.38 IC1.38 12.54,69.85 12.86,69.53 12.86,64.14 13.18,63.82 v31.27,63.82 | v35.4,65.56 36.83,65.56 40.48,61.91 40.48,54.45 40.8,54.13 53.98,54.13 54.29,54.45 54.29,57.31 54.61,57.63 66.99,57.63 v67.31,57.31
  Bottom 0.203: v31.27,63.82 33.97,63.82 34.29,64.14 34.29,65.25 34.61,65.56 v35.4,65.56 | v67.31,57.31 IC5.5
A11  (via drill 0.3)
  Top 0.203: IC2.39 IC1.39 11.91,67.31 12.06,67.15 12.06,63.5 12.38,63.18 v30.8,63.18 | v34.92,64.93 35.08,64.77 36.99,64.77 40.01,61.75 40.01,53.98 40.32,53.66 54.45,53.66 54.77,53.98 54.77,56.83 55.09,57.15 64.61,57.15 v64.77,56.99
  Bottom 0.203: v30.8,63.18 34.61,63.18 34.92,63.5 v34.92,64.93 | v64.77,56.99 IC5.6
A12  (via drill 0.3)
  Top 0.203: IC2.40 IC1.40 10.95,64.77 11.27,64.45 11.27,61.59 11.59,61.28 35.88,61.28 36.67,60.48 36.67,50.64 36.99,50.32 69.06,50.32 v71.44,47.94 71.6,47.78 71.91,47.47 82.55,47.47 82.87,47.78 86.04,47.78 86.2,47.94 97,47.94 97.63,47.31 107.47,47.31 107.79,46.99 115.25,46.99 115.73,47.47 117.47,47.47 v117.63,47.62
  Bottom 0.203: v71.44,47.94 71.44,60.48 71.91,60.96 IC5.3 | v117.63,47.62 117.63,38.89 117.79,38.73 117.79,30.8 118.11,30.48 IC8.3
A13  (via drill 0.3)
  Top 0.203: IC2.41 IC1.41 10.16,62.23 10.48,61.91 10.48,60.96 10.79,60.64 35.88,60.64 36.2,60.33 36.2,50.16 36.51,49.85 68.74,49.85 71.6,46.99 74.3,46.99 82.71,46.99 83.03,47.31 86.2,47.31 86.36,47.47 91.76,47.47 v91.92,47.31 92.08,47.47 96.84,47.47 97.47,46.83 107.31,46.83 107.63,46.51 115.41,46.51 115.89,46.99 119.38,46.99 119.7,47.31 120.81,47.31 121.13,46.99 v121.13,46.67
  Bottom 0.203: v91.92,47.31 91.92,50.01 92.23,50.32 93.66,50.32 93.98,50.64 IC4.13 | IC8.4 121.28,33.02 120.97,33.34 120.97,46.51 v121.13,46.67
A14  (via drill 0.3)
  Top 0.203: IC2.42 IC1.42 22.07,59.69 23.02,58.74 35.4,58.74 35.72,58.42 35.72,49.69 36.04,49.37 68.58,49.37 71.44,46.51 74.14,46.51 82.87,46.51 83.19,46.83 84.45,46.83 84.77,46.51 86.2,46.51 v86.36,46.67 86.68,46.99 90.81,46.99 91.12,46.67 92.55,46.67 92.87,46.99 96.68,46.99 97.31,46.35 107,46.35 107.31,46.04 115.57,46.04 116.05,46.51 120.02,46.51 v120.17,46.67
  Bottom 0.203: v86.36,46.67 IC4.10 | v120.17,46.67 120.17,39.21 120.49,38.89 120.49,33.34 120.17,33.02 IC8.5
A15  (via drill 0.3)
  Top 0.203: IC2.43 IC1.43 22.07,57.15 23.02,58.1 34.92,58.1 35.24,57.78 35.24,49.21 35.56,48.9 68.42,48.9 71.28,46.04 73.98,46.04 83.03,46.04 83.34,46.35 84.3,46.35 84.61,46.04 86.52,46.04 87,46.51 90.33,46.51 v90.49,46.35 90.81,46.35 90.96,46.2 92.71,46.2 93.03,46.51 96.52,46.51 97.16,45.88 106.84,45.88 107.16,45.56 115.73,45.56 116.2,46.04 v121.92,46.04
  Bottom 0.203: v90.49,46.35 90.01,46.83 90.01,60.48 89.53,60.96 IC4.6 | v121.92,46.04 IC8.6
A16  (via drill 0.3)
  Top 0.203: IC2.44 IC1.44 22.86,54.61 23.18,54.93 23.18,55.72 23.5,56.04 31.43,56.04 32.86,54.61 32.86,52.39 34.77,50.48 34.77,48.74 35.08,48.42 68.26,48.42 71.12,45.56 73.82,45.56 83.66,45.56 v83.82,45.72 83.98,45.56 87,45.56 87.47,46.04 90.01,46.04 90.33,45.72 93.03,45.72 93.19,45.88 v95.25,45.88 96.52,45.88 97,45.4 106.52,45.4 106.84,45.09 116.05,45.09 116.36,45.4 v119.38,45.4
  Bottom 0.203: v83.82,45.72 IC6.15 | v95.25,45.88 95.25,60.64 95.57,60.96 IC4.3 | v119.38,45.4 IC8.7
A17  (via drill 0.3)
  Top 0.203: IC2.45 IC1.45 22.7,52.07 23.02,52.39 23.02,53.18 23.34,53.5 31.11,53.5 31.43,53.18 31.43,51.91 33.34,50.01 33.34,47.31 33.66,46.99 67.15,46.99 68.42,45.72 68.42,45.4 68.74,45.09 70.48,45.09 70.96,45.09 73.5,45.09 73.66,45.09 87.31,45.09 87.79,45.56 89.85,45.56 90.33,45.09 v91.44,45.09 93.19,45.09 93.5,45.4 94.46,45.4 94.77,45.09 96.68,45.09 96.84,44.93 106.36,44.93 106.68,44.61 116.36,44.61 116.52,44.77 v118.27,44.77
  Bottom 0.203: v91.44,45.09 IC6.9 | IC8.8 118.59,35.56 118.27,35.88 v118.27,44.77 118.43,44.93 118.43,60.8 118.11,61.12 IC3.13
A18  (via drill 0.3)
  Top 0.203: IC2.46 IC1.46 20.95,49.53 21.27,49.85 21.27,50.64 21.59,50.96 30.48,50.96 31.91,49.53 31.91,45.88 32.23,45.56 64.45,45.56 64.93,45.09 66.36,45.09 66.67,45.4 67.63,45.4 68.42,44.61 70.64,44.61 70.96,44.61 73.18,44.61 73.5,44.61 87.63,44.61 88.11,45.09 89.69,45.09 90.33,44.45 93.66,44.45 v93.98,44.77 94.14,44.61 96.52,44.61 96.68,44.45 106.05,44.45 106.36,44.13 v116.84,44.13 v123.35,44.13
  Bottom 0.203: v93.98,44.77 IC6.7 | IC8.9 v116.84,44.13 | v123.35,44.13 123.35,51.75 123.51,51.91 123.51,60.8 123.83,61.12 IC3.10
A19  (via drill 0.3)
  Top 0.203: IC2.47 IC1.47 21.75,46.99 22.07,47.31 22.07,50.16 22.38,50.48 30.32,50.48 31.43,49.37 31.43,45.4 31.75,45.09 64.29,45.09 64.77,44.61 66.52,44.61 66.83,44.93 67.47,44.93 68.26,44.13 70.8,44.13 71.12,44.13 73.03,44.13 73.34,44.13 87.79,44.13 88.27,44.61 89.53,44.61 90.17,43.97 91.76,43.97 92.08,43.66 93.82,43.66 94.3,44.13 95.25,44.13 95.41,43.97 v96.2,43.97 105.89,43.97 106.36,43.5 v113.03,43.5 v122.71,43.5 | v96.52,37.15 96.2,36.83 95.73,36.83 95.41,36.51 95.41,33.34 95.09,33.02 IC6.5
  Bottom 0.203: v96.2,43.97 96.2,39.53 96.52,39.21 v96.52,37.15 | IC8.14 112.71,35.56 113.03,35.88 v113.03,43.5 | v122.71,43.5 122.71,53.02 IC3.6
A20  (via drill 0.3)
  Top 0.203: IC2.48 IC1.48 20.8,44.45 21.11,44.13 21.11,43.18 21.43,42.86 43.66,42.86 44.93,44.13 63.98,44.13 64.45,43.66 70.96,43.66 71.44,43.66 73.03,43.66 73.18,43.66 87.95,43.66 88.42,44.13 89.38,44.13 90.01,43.5 91.6,43.5 91.92,43.18 94.46,43.18 v94.77,43.5 94.93,43.34 95.89,43.34 96.04,43.18 101.44,43.18 101.76,43.5 105.73,43.5 106.36,42.86 108.9,42.86 | 108.9,42.86 109.22,42.86 v114.62,42.86 | IC8.15 109.22,42.55 108.9,42.86
  Bottom 0.203: IC6.3 94.46,30.48 94.93,30.96 94.93,40.64 94.77,40.8 v94.77,43.5 | v114.62,42.86 IC3.3
A21  (via drill 0.3)
  Top 0.203: IC2.50 IC1.50 15.88,39.37 16.19,39.05 16.19,25.4 16.51,25.08 34.92,25.08 35.24,25.4 35.24,26.67 35.56,26.99 42.39,26.99 43.66,28.26 43.66,33.34 43.5,33.5 43.5,34.13 43.66,34.29 43.66,40.32 45.56,42.23 62.55,42.23 62.87,41.91 64.14,41.91 64.45,42.23 71.44,42.23 71.75,42.23 72.39,42.23 72.71,42.23 89.38,42.23 89.69,42.55 91.28,42.55 91.6,42.23 v95.41,42.23 101.76,42.23 101.92,42.39 102.71,42.39 102.87,42.23 v108.27,42.23
  Bottom 0.203: v95.41,42.23 95.41,25.88 94.93,25.4 IC6.43 | v108.27,42.23 108.27,35.88 108.58,35.56 IC8.16
A22  (via drill 0.3)
  Top 0.203: IC2.51 IC1.51 14.76,36.83 15.08,36.51 15.08,23.5 15.4,23.18 35.4,23.18 36.27,24.05 42.86,24.05 43.18,24.37 43.18,26.51 44.61,27.94 44.61,33.34 44.93,33.66 44.93,33.97 44.61,34.29 44.61,40.01 45.88,41.27 62.23,41.27 62.55,40.96 64.45,40.96 64.77,41.27 89.69,41.27 90.01,41.59 90.96,41.59 91.44,41.12 v100.01,41.12 106.36,41.12 106.68,40.8 IC8.17
  Bottom 0.203: IC6.42 96.84,25.72 98.27,25.72 98.74,26.19 99.06,26.51 99.06,32.7 100.01,33.66 v100.01,41.12
A23  (via drill 0.3)
  Top 0.203: IC2.52 IC1.52 13.65,34.29 13.97,33.97 13.97,23.02 14.29,22.7 35.56,22.7 35.72,22.86 36.35,22.86 37.15,22.07 43.81,22.07 44.13,22.38 44.13,26.83 45.09,27.78 45.09,33.18 45.4,33.5 45.4,34.13 45.09,34.45 45.09,39.85 46.04,40.8 62.07,40.8 62.39,40.48 64.61,40.48 64.93,40.8 89.85,40.8 90.17,41.12 90.81,41.12 91.44,40.48 v93.19,40.48 v104.14,40.48
  Bottom 0.203: v104.14,40.48 IC8.18 | IC6.41 93.34,22.86 92.87,23.34 92.87,38.89 93.19,39.21 v93.19,40.48
AS  (via drill 0.3)
  Top 0.203: IC2.6 IC1.6 33.97,16.51 34.61,15.88 34.92,15.88 37.31,13.49 37.31,8.26 37.62,7.94 54.61,7.94 v54.77,8.1 54.93,7.94 76.68,7.94 76.99,8.26 81.12,8.26 81.44,7.94 96.36,7.94 v96.52,8.1 | v54.77,10.32 54.77,20 55.09,20.32 IC7.29 | IC6.40 v96.52,15.72
  Bottom 0.203: v54.77,8.1 v54.77,10.32 | IC6.40 99.38,22.86 99.69,23.18 99.69,25.08 100.01,25.4 IC8.26 | R32.1 IC2.6 | v96.52,15.72 v96.52,8.1
B_DRA0
  Top 0.203: R10.2 127,78.58 126.68,78.9 125.41,78.9 125.09,79.22 CON2.12
B_DRA1
  Top 0.203: CON2.13 123.83,79.22 124.46,78.58 R11.2
B_DRA2
  Top 0.203: R12.2 121.92,76.99 122.56,77.63 CON2.14
B_DRA3
  Top 0.203: R13.2 119.38,77.23 119.7,77.55 120.97,77.55 121.28,77.87 CON2.15
B_DRA4
  Top 0.203: CON2.16 120.02,78.42 119.7,78.11 117.16,78.11 116.84,77.79 R14.2
B_DRA5
  Top 0.203: R15.2 114.3,78.42 114.62,78.74 118.43,78.74 118.75,79.06 CON2.17
B_DRA6
  Top 0.203: CON2.18 117.47,79.53 117.16,79.22 112.08,79.22 111.76,78.9 R16.2
B_DRA7  (via drill 0.3)
  Top 0.203: CON2.28 104.78,71.91 v104.46,71.6
  Bottom 0.203: v104.46,71.6 R2.2
B_DRA8
  Top 0.203: R4.2 91.6,72.39 91.92,72.07 97.47,72.07 97.79,72.39 97.79,76.68 98.11,76.99 100.65,76.99 100.97,77.31 CON2.31
B_DRA9
  Top 0.203: CON2.32 99.69,78.26 99.38,77.95 97,77.95 96.68,77.63 R5.2
B_LCAS/CAS0
  Top 0.203: CON2.40 84.45,80.8 84.77,80.49 84.77,78.74 85.09,78.42 86.2,78.42 86.52,78.11 RN1.7 R8.2
B_LCAS/CAS1
  Top 0.203: CON2.43 80.64,77.95 80.33,77.63 79.22,77.63 78.9,77.31 RN1.4 R18.2
B_RAS0
  Top 0.203: CON2.44 79.38,78.74 79.06,78.42 77.31,78.42 76.99,78.11 76.99,76.52 76.83,76.36 RN1.3 R19.2
B_RAS1
  Top 0.203: CON2.45 78.11,79.53 77.79,79.22 76.52,79.22 76.2,78.9 76.2,78.42 75.56,77.79 74.14,77.79 73.82,77.47 RN1.2 R38.2
B_RAS2
  Top 0.203: R7.2 RN1.8 89.06,79.38 89.38,79.69 96.84,79.69 97.16,80.01 CON2.34
B_RAS3
  Top 0.203: R6.2 94.14,75.56 93.82,75.88 RN1.9 91.6,78.58 91.92,78.9 96.04,78.9 96.36,78.9 98.11,78.9 98.42,79.22 CON2.33
B_RW
  Top 0.203: CON2.47 75.56,79.3 75.25,78.98 72.87,78.98 72.55,78.66 72.55,73.66 72.23,73.34 R39.2
B_UCAS/CAS2
  Top 0.203: CON2.41 83.98,80.49 RN1.6 R9.2
B_UCAS/CAS3
  Top 0.203: CON2.42 81.92,76.83 81.92,76.36 RN1.5 R17.2
BERR
  Top 0.203: IC2.22 IC1.22
BG
  Top 0.203: IC2.11 IC1.11
BGACK
  Top 0.203: IC2.12 IC1.12
BR
  Top 0.203: IC2.13 IC1.13
CDAC  (via drill 0.3)
  Top 0.203: v111.76,9.37 111.6,9.21 97.95,9.21 97.47,9.68 93.34,9.68 93.03,9.37 81.92,9.37 81.28,10 78.58,10 78.26,9.68 76.52,9.68 76.2,9.37 58.9,9.37 | 58.9,9.37 56.04,9.37 55.72,9.68 53.98,9.68 53.66,9.37 53.18,9.37 52.86,9.68 CDAC_BOARD.MP | IC8.33 112.39,20.32 112.71,20 112.71,15.88 112.79,15.8 112.79,11.83 v112.71,11.75 | IC7.33 60.96,17.94 60.64,17.62 59.69,17.62 59.37,17.3 59.37,9.84 58.9,9.37
  Bottom 0.203: v112.71,11.75 112.71,10.64 112.71,9.68 112.39,9.37 v111.76,9.37
CHOICE_RESET  (via drill 0.3)
  Top 0.203: v119.38,8.1 119.54,7.94 126.84,7.94 127.16,8.26 127.16,11.11 127.95,11.91 127.95,15.56 128.43,16.03 128.43,20.48 128.91,20.95 128.91,25.24 129.38,25.72 129.38,41.43 130.18,42.23 130.18,44.93 129.86,45.24 129.86,46.51 130.49,47.15 130.49,51.44 130.97,51.91 v130.97,54.29
  Bottom 0.203: JP4.2 v119.38,8.1 | v130.97,54.29 153.35,54.29 CON1.1
CLOCK_CPU  (via drill 0.3)
  Top 0.203: IC1.15 42.39,39.37 | 42.39,39.37 42.7,39.05 42.7,36.99 41.75,36.04 v41.75,32.86 | IC7.31 57.63,20.32 57.31,20.64 57.31,24.13 57.31,31.43 56.99,31.75 50.32,31.75 49.21,32.86 v47.31,32.86 | v88.9,43.5 88.58,43.18 73.03,43.18 72.71,43.18 71.44,43.18 71.12,43.18 64.14,43.18 63.82,42.86 63.18,42.86 62.87,43.18 45.24,43.18 42.7,40.64 42.7,39.69 42.39,39.37
  Bottom 0.203: v41.75,32.86 v47.31,32.86 | IC6.11 v88.9,43.5 | R35.1 28.26,40.64 28.57,40.32 IC1.15
CLOCK_OSZ
  Top 0.203: IC11.8 49.85,10.32 50.32,10.79 50.32,17.7 50.72,18.1 51.2,18.1 51.59,18.49 51.59,21.35 51.83,21.59 54.37,21.59 54.61,21.83 54.61,25.16 54.37,25.4 IC7.26
CLOCK_SOCKET  (via drill 0.3)
  Top 0.203: IC2.15 25.4,40.32 25.72,40.64 42.07,40.64 45.09,43.66 63.34,43.66 v63.5,43.5
  Bottom 0.203: v63.5,43.5 IC7.11
D0  (via drill 0.3)
  Top 0.203: IC2.5 IC1.5 34.92,13.97 35.88,13.02 35.88,6.83 36.2,6.51 77.95,6.51 78.26,6.83 79.22,6.83 79.53,6.51 128.27,6.51 128.59,6.83 128.59,10.48 129.38,11.27 129.38,15.08 129.86,15.56 129.86,20 130.33,20.48 130.33,24.77 130.81,25.24 130.81,40.96 131.6,41.75 131.6,48.74 131.76,48.9 v131.76,53.34 131.92,53.5 131.92,66.67 v131.76,66.83
  Bottom 0.203: v131.76,53.34 IC10.3 | v131.76,66.83 136.21,66.83 137.32,66.83 137.79,67.31 CON2.2
D1  (via drill 0.3)
  Top 0.203: IC2.4 IC1.4 34.13,11.43 34.45,11.11 34.45,5.4 34.77,5.08 129.7,5.08 130.02,5.4 130.02,10 130.81,10.79 130.81,14.61 131.29,15.08 131.29,19.37 132.08,20.16 132.08,43.66 132.24,43.81 v132.24,48.26 132.4,48.42 132.4,67.63 v132.24,67.79
  Bottom 0.203: v132.24,48.26 IC10.5 | v132.24,67.79 134.94,67.79 135.25,68.1 CON2.4
D2  (via drill 0.3)
  Top 0.203: IC2.3 IC1.3 32.7,8.89 33.02,8.57 33.02,3.97 33.34,3.65 131.13,3.65 131.44,3.97 131.44,9.37 132.4,10.32 132.4,12.22 132.56,12.38 132.56,38.73 132.72,38.89 v132.72,43.18 132.87,43.34 132.87,68.1 132.56,68.42 v131.44,68.42
  Bottom 0.203: v132.72,43.18 IC10.7 | v131.44,68.42 131.44,73.03 131.44,79.22 131.76,79.53 132.4,79.53 132.72,79.85 CON2.6
D3  (via drill 0.3)
  Top 0.203: IC2.2 IC1.2 31.27,6.35 31.59,6.03 31.59,2.54 31.91,2.22 133.03,2.22 133.35,2.54 133.35,11.91 133.51,12.06 133.51,22.38 133.67,22.54 v133.67,38.1 133.83,38.26 133.83,68.42 132.56,69.69 v130.18,69.69
  Bottom 0.203: v133.67,38.1 IC10.9 | v130.18,69.69 130.18,71.91 CON2.8
D4
  Top 0.203: IC2.1 IC1.1 29.84,3.81 30.16,3.49 30.16,1.11 30.48,0.79 134.94,0.79 135.25,1.11 135.25,21.11 | 135.25,21.11 135.25,21.59 135.25,68.9 132.87,71.28 110.81,71.28 110.33,71.75 110.33,79.38 110.65,79.69 113.35,79.69 114.62,79.69 114.94,80.01 CON2.20 | IC9.3 135.73,21.59 135.25,21.11
D5  (via drill 0.3)
  Top 0.203: IC2.64 IC1.64 20.64,3.81 21.59,4.76 30.32,4.76 30.64,4.45 30.64,1.59 30.96,1.27 134.3,1.27 134.62,1.59 v134.62,16.51 134.62,22.07 134.78,22.23 134.78,68.74 132.72,70.8 110.65,70.8 109.86,71.6 109.86,79.53 109.86,79.85 110.17,80.17 112.08,80.17 112.39,80.49 CON2.22
  Bottom 0.203: v134.62,16.51 IC9.5
D6  (via drill 0.3)
  Top 0.203: IC2.63 IC1.63 20.48,6.35 21.59,5.24 30.8,5.24 31.11,4.92 31.11,2.06 31.43,1.75 133.67,1.75 133.99,2.06 v133.99,11.43 133.99,22.07 134.3,22.38 134.3,68.58 132.56,70.33 110.49,70.33 109.38,71.44 109.38,79.69 109.38,80.17 109.86,80.64 CON2.24
  Bottom 0.203: v133.99,11.43 IC9.7
D7  (via drill 0.3)
  Top 0.203: IC2.62 IC1.62 7.14,8.89 7.46,8.57 7.46,7.62 7.78,7.3 31.75,7.3 32.07,6.99 32.07,3.02 32.38,2.7 132.4,2.7 132.72,3.02 v132.72,6.35 132.87,6.51 132.87,12.06 133.03,12.22 133.03,38.58 133.35,38.89 133.35,68.26 132.56,69.06 128.43,69.06 127.64,69.85 110.33,69.85 108.9,71.28 108.9,79.38 108.58,79.69 107.63,79.69 107.31,80.01 CON2.26
  Bottom 0.203: v132.72,6.35 IC9.9
D8  (via drill 0.3)
  Top 0.203: IC2.61 IC1.61 8.1,11.43 8.41,11.11 8.41,8.1 8.73,7.78 30.96,7.78 | v132.08,8.89 132.08,3.49 131.76,3.17 32.86,3.17 32.54,3.49 32.54,7.46 32.23,7.78 30.96,7.78 | 30.96,7.78 v30.8,7.94
  Bottom 0.203: v132.08,8.89 IC9.8 | CON2.49 73.03,79.06 72.71,78.74 41.27,78.74 37.62,75.25 37.62,55.56 37.31,55.24 IC12.18 31.11,55.24 30.8,54.93 v30.8,7.94
D9  (via drill 0.3)
  Top 0.203: IC2.60 IC1.60 8.57,13.97 8.89,13.65 8.89,10.16 9.21,9.84 31.75,9.84 | 31.75,9.84 33.02,9.84 33.5,9.37 33.5,4.45 33.81,4.13 130.65,4.13 130.97,4.45 130.97,9.53 131.92,10.48 v131.92,13.97 | CON2.51 70.25,81.04 v70.25,78.11 | v31.43,9.53 31.75,9.84
  Bottom 0.203: v131.92,13.97 IC9.6 | v70.25,78.11 41.27,78.11 38.1,75.09 38.1,54.29 37.78,53.98 IC12.17 31.59,53.98 31.27,53.66 31.27,9.68 v31.43,9.53
D10  (via drill 0.3)
  Top 0.203: IC2.59 IC1.59 8.89,16.51 9.37,16.03 9.37,10.64 9.68,10.32 32.23,10.32 | 32.23,10.32 33.5,10.32 33.97,9.84 33.97,4.92 34.29,4.6 130.18,4.6 130.49,4.92 130.49,9.68 131.29,10.48 131.29,14.45 131.92,15.08 v131.92,19.05 | CON2.53 67.87,81.2 v67.87,77.47 | v31.91,10.64 32.23,10.32
  Bottom 0.203: v131.92,19.05 IC9.4 | v67.87,77.47 41.27,77.47 38.58,74.77 38.58,53.02 38.26,52.7 IC12.16 32.07,52.7 31.75,52.39 31.75,10.79 v31.91,10.64
D11  (via drill 0.3)
  Top 0.203: IC2.58 IC1.58 9.53,19.05 9.84,18.73 9.84,12.7 10.16,12.38 32.7,12.38 | 32.7,12.38 34.61,12.38 34.92,12.06 34.92,5.87 35.24,5.56 129.22,5.56 129.54,5.87 129.54,10.16 130.33,10.95 130.33,14.76 130.81,15.24 130.81,19.68 131.44,20.32 v131.44,24.13 | CON2.55 v65.41,76.83 | v32.38,12.06 32.7,12.38
  Bottom 0.203: v131.44,24.13 IC9.2 | v65.41,76.83 41.27,76.83 39.05,74.61 39.05,51.75 38.73,51.44 IC12.15 32.54,51.44 32.23,51.12 32.23,12.22 v32.38,12.06
D12  (via drill 0.3)
  Top 0.203: IC2.57 IC1.57 10,21.59 10.32,21.27 10.32,13.18 10.64,12.86 33.34,12.86 | 33.34,12.86 35.08,12.86 35.4,12.54 35.4,6.35 35.72,6.03 78.58,6.03 v78.74,6.19 78.9,6.03 128.75,6.03 129.06,6.35 129.06,10.32 129.86,11.11 129.86,14.92 130.33,15.4 130.33,19.84 130.81,20.32 130.81,24.61 131.44,25.24 v131.44,40.64 | IC6.28 v78.74,12.7 | CON2.57 v62.87,76.2 | v32.86,13.34 33.34,12.86
  Bottom 0.203: v131.44,40.64 IC10.8 | v78.74,12.7 v78.74,6.19 | v62.87,76.2 41.27,76.2 39.53,74.45 39.53,50.48 39.21,50.16 IC12.14 33.02,50.16 32.7,49.85 32.7,13.49 v32.86,13.34
D13  (via drill 0.3)
  Top 0.203: IC2.56 IC1.56 10.64,24.13 10.95,23.81 10.95,15.24 11.27,14.92 33.66,14.92 | 33.66,14.92 34.61,14.92 36.35,13.18 36.35,7.3 36.67,6.99 77.63,6.99 77.95,7.3 79.53,7.3 79.85,6.99 80.17,6.99 v80.33,7.14 80.49,6.99 127.79,6.99 128.11,7.3 128.11,10.64 128.91,11.43 128.91,15.24 129.38,15.72 129.38,20.16 129.86,20.64 129.86,24.92 130.33,25.4 130.33,41.12 131.13,41.91 131.13,45.56 v130.97,45.72 | v80.33,13.18 80.33,14.29 80.17,14.45 80.17,25.08 80.49,25.4 IC6.27 | CON2.61 v57.78,75.56 | v33.34,14.61 33.66,14.92
  Bottom 0.203: v80.33,7.14 v80.33,13.18 | IC10.6 v130.97,45.72 | v57.78,75.56 41.27,75.56 40.01,74.3 40.01,49.21 39.69,48.9 IC12.13 33.5,48.9 33.18,48.58 33.18,14.76 v33.34,14.61
D14  (via drill 0.3)
  Top 0.203: IC2.55 IC1.55 11.59,26.67 11.91,26.35 11.91,15.72 12.22,15.4 34.13,15.4 | 34.13,15.4 34.77,15.4 36.83,13.34 36.83,7.78 37.15,7.46 77.15,7.46 v77.31,7.62 77.47,7.78 80.96,7.78 81.28,7.46 110.33,7.46 v110.49,7.62 110.65,7.46 127.32,7.46 127.64,7.78 127.64,10.95 128.43,11.75 128.43,15.4 128.91,15.88 128.91,20.32 129.38,20.8 129.38,25.08 129.86,25.56 129.86,41.27 130.65,42.07 130.65,45.09 130.33,45.4 130.33,46.35 131.13,47.15 v131.13,50.8 | v77.31,12.22 77.31,25.08 77.63,25.4 IC6.26 | CON2.63 v55.24,74.93 | v33.81,15.72 34.13,15.4 | IC8.27 110.17,25.4 110.49,25.08 110.49,16.99 110.49,16.51 v110.49,12.86
  Bottom 0.203: v77.31,7.62 v77.31,12.22 | IC10.4 v131.13,50.8 | v55.24,74.93 41.27,74.93 40.48,74.14 40.48,47.94 40.16,47.62 IC12.12 33.97,47.62 33.66,47.31 33.66,15.88 v33.81,15.72 | v110.49,12.86 110.49,7.78 v110.49,7.62
D15  (via drill 0.3)
  Top 0.203: IC2.54 IC1.54 12.7,29.21 13.02,28.89 13.02,17.78 13.34,17.46 32.7,17.46 33.02,17.14 v34.29,17.14 34.29,16.83 34.77,16.35 35.08,16.35 37.78,13.65 37.78,8.73 38.1,8.41 53.98,8.41 54.29,8.73 55.24,8.73 55.56,8.41 76.52,8.41 76.83,8.73 79.53,8.73 v79.69,8.89 79.85,8.73 81.28,8.73 81.6,8.41 95.73,8.41 96.04,8.73 97.16,8.73 97.79,8.1 v100.49,8.1 100.65,7.94 109.86,7.94 110.17,8.26 110.81,8.26 111.12,7.94 118.27,7.94 119.06,8.73 119.86,8.73 120.17,8.41 125.09,8.41 126.21,9.53 126.21,11.43 127,12.22 127,15.88 127.48,16.35 127.48,20.8 127.95,21.27 127.95,25.56 127.48,26.04 127.48,26.99 127.95,27.46 127.95,41.91 128.75,42.7 128.75,44.45 128.43,44.77 128.43,46.99 129.06,47.62 129.06,52.07 129.38,52.39 129.38,55.09 129.86,55.56 v129.86,55.88 | v79.69,12.06 79.69,27.62 80.01,27.94 IC6.25 | CON2.65 v52.7,74.3 | v100.49,15.88 100.49,16.19 102.08,17.78 102.08,22.54 102.39,22.86 IC8.28
  Bottom 0.203: v79.69,8.89 v79.69,12.06 | v52.7,74.3 41.27,74.3 40.96,73.98 40.96,46.67 40.64,46.35 IC12.11 34.45,46.35 34.13,46.04 34.13,17.3 v34.29,17.14 | IC10.2 v129.86,55.88 | v100.49,15.88 v100.49,8.1
DA0
  Top 0.203: IC10.17 155.89,50.8 156.21,51.12 CON1.4
DA1
  Top 0.203: IC10.15 146.84,45.72 147.16,46.04 147.16,48.1 147.48,48.42 155.89,48.42 156.21,48.74 CON1.6
DA2
  Top 0.203: CON1.8 156.21,46.2 155.89,45.88 148.43,45.88 148.11,45.56 148.11,45.09 147.8,44.77 147.48,44.77 147.32,44.61 147.32,43.34 146.84,42.86 146.84,40.96 146.53,40.64 IC10.13
DA3
  Top 0.203: CON1.10 156.21,43.66 155.89,43.34 148.59,43.34 147.8,42.55 147.8,40.64 147.48,40.32 147.48,38.26 147,37.78 147,35.88 146.69,35.56 IC10.11
DA4
  Top 0.203: IC9.17 147,19.05 147.32,19.37 147.32,34.45 147.96,35.08 147.96,37.47 148.43,37.94 148.43,40.01 148.75,40.32 148.75,40.48 149.07,40.8 155.89,40.8 156.21,41.12 CON1.12
DA5
  Top 0.203: IC9.15 147.96,13.97 148.27,14.29 148.27,34.13 148.91,34.77 148.91,37.15 149.38,37.62 149.38,37.94 149.7,38.26 155.89,38.26 156.21,38.58 CON1.14
DA6
  Top 0.203: IC9.13 148.91,8.89 149.22,9.21 149.22,33.81 149.86,34.45 149.86,35.4 150.18,35.72 155.89,35.72 156.21,36.04 CON1.16
DA7
  Top 0.203: CON1.18 156.21,33.5 155.89,33.18 150.5,33.18 150.18,32.86 150.18,4.13 149.86,3.81 IC9.11
DA8
  Top 0.203: IC9.12 149.22,6.35 149.7,6.83 149.7,33.66 150.34,34.29 CON1.17
DA9
  Top 0.203: IC9.14 148.27,11.43 148.75,11.91 148.75,33.97 149.38,34.61 149.38,36.51 149.7,36.83 CON1.15
DA10
  Top 0.203: IC9.16 147.32,16.51 147.8,16.99 147.8,34.29 148.43,34.92 148.43,37.31 148.91,37.78 148.91,39.05 149.22,39.37 CON1.13
DA11
  Top 0.203: IC9.18 146.37,21.59 146.84,22.07 146.84,34.77 147.48,35.4 147.48,37.62 147.96,38.1 147.96,40.16 148.27,40.48 148.27,41.59 148.59,41.91 CON1.11
DA12
  Top 0.203: CON1.9 148.11,44.45 147.8,44.13 147.8,43.18 147.32,42.7 147.32,40.8 147,40.48 147,38.42 146.69,38.1 IC10.12
DA13
  Top 0.203: CON1.7 147.96,46.99 147.64,46.67 147.64,45.56 146.84,44.77 146.84,43.5 146.53,43.18 IC10.14
DA14
  Top 0.203: IC10.16 146.21,48.26 146.53,48.58 146.53,49.21 146.84,49.53 CON1.5
DA15
  Top 0.203: IC10.18 146.69,53.34 147,53.02 147,52.39 147.32,52.07 CON1.3
DRA0
  Top 0.203: IC3.4 117.16,58.58 117.47,58.9 127.95,58.9 128.27,59.21 128.27,66.99 127.95,67.31 R10.1
DRA1
  Top 0.203: R11.1 124.46,68.1 124.78,68.42 128.91,68.42 129.22,68.1 129.22,57.63 128.91,57.31 125.09,57.31 124.78,56.99 IC3.7
DRA2
  Top 0.203: IC3.9 127.32,64.77 127,65.09 122.24,65.09 121.92,65.41 R12.1
DRA3
  Top 0.203: IC3.12 119.7,66.99 R13.1
DRA4
  Bottom 0.203: IC4.4 93.98,64.29 94.3,64.61 103.82,64.61 110.65,64.61 110.97,64.61 116.36,64.61 116.52,64.61 116.84,64.93 R14.1
DRA5  (via drill 0.3)
  Top 0.203: v87.63,64.45 87.79,64.29 98.42,64.29 99.54,65.41 v104.3,65.41
  Bottom 0.203: v87.63,64.45 86.68,64.45 86.36,64.14 IC4.7 | v104.3,65.41 110.65,65.41 110.97,65.41 113.98,65.41 114.3,65.72 R15.1
DRA6  (via drill 0.3)
  Top 0.203: v85.57,67.94 97,67.94 98.9,66.04 v103.66,66.04
  Bottom 0.203: IC4.9 83.82,55.56 84.14,55.88 84.77,55.88 85.09,56.2 85.09,63.5 85.57,63.98 v85.57,67.94 | v103.66,66.04 111.44,66.04 111.76,66.36 R16.1
DRA7
  Bottom 0.203: IC4.12 92.08,53.34 92.55,53.82 92.55,65.56 92.55,68.9 92.55,71.28 92.87,71.6 R2.1
DRA8  (via drill 0.3)
  Top 0.203: v69.85,66.99 70.17,67.31 83.82,67.31 91.28,67.31 91.6,66.99 R4.1
  Bottom 0.203: IC5.4 v69.85,66.99
DRA9  (via drill 0.3)
  Top 0.203: v62.23,64.45 62.55,64.45 62.71,64.45 76.52,64.45 76.99,64.45 77.95,64.45 78.11,64.45 84.3,64.45 84.61,64.45 84.93,64.45 86.68,64.45 87.31,65.09 87.95,65.09 88.27,64.77 96.36,64.77 96.68,65.09 R5.1
  Bottom 0.203: v62.23,64.45 IC5.7
DTACK_CPU  (via drill 0.3)
  Top 0.203: IC1.10 33.5,26.67 33.81,26.99 33.81,28.26 34.13,28.57 v35.24,28.57 | IC11.4 45.24,17.94 45.56,18.26 45.56,18.89 45.88,19.21 49.69,19.21 50.01,19.53 50.01,22.54 50.32,22.86 IC7.28
  Bottom 0.203: IC11.4 JP3.1 36.99,18.57 36.67,18.89 35.72,18.89 35.08,19.53 35.08,28.42 v35.24,28.57 | R37.1 28.26,27.94 28.57,27.62 IC1.10
DTACK_SOCKET  (via drill 0.3)
  Top 0.203: IC2.10 25.4,25.88 25.72,25.56 34.45,25.56 34.77,25.88 34.77,27.15 35.08,27.46 42.23,27.46 43.02,28.26 v43.02,35.56
  Bottom 0.203: v43.02,35.56 IC7.18
E_CPU  (via drill 0.3)
  Top 0.203: IC1.20 30,52.07 32.38,49.69 32.38,46.35 32.7,46.04 65.56,46.04 v65.88,45.72
  Bottom 0.203: v65.88,45.72 66.04,45.56 IC7.9 | R36.1 28.26,50.8 28.57,51.12 IC1.20
E_SOCKET  (via drill 0.3)
  Top 0.203: IC2.20 25.4,52.39 26.04,53.02 30.64,53.02 30.96,52.7 30.96,51.75 32.86,49.85 32.86,46.83 33.18,46.51 66.67,46.51 v67.15,46.04
  Bottom 0.203: v67.15,46.04 67.47,46.04 67.79,45.72 67.79,38.73 67.63,38.58 67.63,35.88 67.94,35.56 IC7.8 | R24.1 IC2.20
FC0
  Top 0.203: IC2.28 IC1.28
FC1
  Top 0.203: IC2.27 IC1.27
FC2
  Top 0.203: IC2.26 IC1.26
GND  (via drill 0.3)
  Top 0.203: X1.21 43.23,71.01 43.18,70.96
  Top 0.61: 43.18,70.96 43.1,70.96 v41.75,70.96
  other vias: 10.64,5.08 22.54,6.35 21.43,8.89 21.43,11.59 7.46,10.16 7.62,12.86 7.62,15.4 21.43,13.97 17.62,16.35 7.94,17.94 7.94,20.48 7.94,23.02 7.94,25.4 20.95,24.29 7.94,27.94 8.41,35.56 8.26,38.26 120.65,79.38 111.12,78.26 20.16,62.23 20.16,64.77 20.16,67.31 20.16,70.01 31.11,62.23 31.27,59.69 43.5,15.72 53.82,11.59 102.23,10.79 122.71,11.27 141.13,8.89 141.13,11.43 151.61,9.05 151.45,11.43 151.45,13.97 96.04,69.37 77.15,58.58 91.44,58.26 140.97,23.97 119.38,18.89 103.66,19.53 108.74,24.61 90.65,31.27 91.44,26.67 80.8,26.67 20.8,20.32 38.73,43.66 80.49,39.21 39.69,41.75 46.2,21.91 43.66,20.48 31.27,64.77 31.11,67.31 31.43,69.85 43.18,23.02 63.34,65.09 80.64,70.48 104.46,15.72 106.2,21.59 59.37,67.31 26.99,73.66 30.32,71.6 37.78,23.02 52.55,20.32 36.04,22.23 46.99,59.37 31.91,57.15 33.81,54.61 33.81,53.34 33.97,52.07 36.83,40.01 36.51,38.42 39.53,38.42 73.03,39.21 79.53,52.07 79.85,59.85 70.17,69.06 152.08,22.07 90.17,18.89 15.56,81.6 14.76,78.9 14.13,76.36 13.18,73.82 23.18,59.85 23.18,56.99 10.32,63.5 10.95,66.2 11.75,68.74 12.7,71.12 18.57,78.11 21.59,58.42 17.94,53.66 23.18,48.26 21.11,47.94 18.41,47.94 22.86,44.77 22.86,26.35 20.32,5.08 25.72,1.59 3.33,1.27 36.04,79.22 98.74,18.73 9.37,60.8 129.06,76.68 133.83,79.53 106.52,80.01 47.78,38.73 58.58,33.5 52.23,56.52 125.89,66.04 136.21,60.48 143.19,52.23 140.49,3.33 115.73,9.84 36.83,16.51 104.46,68.74 102.23,67.47 93.5,69.37 89.38,69.69 79.69,61.44 85.96,16.91 73.26,20.16 115.49,65.64 76.52,71.04 73.42,78.34 74.85,79.61 76.83,80.17 80.01,79.77 81.28,79.93 83.11,79.53 89.06,84.06 93.19,84.22 100.17,77.79 90.81,79.06 118.11,79.77 118.19,77.15 123.43,78.26 125.73,77.79 127.71,79.93 130.81,79.85 134.22,77.95 134.62,72.95 144.3,82.95 125.25,14.13 123.75,20.08 112.95,31.04 85.72,29.21 83.58,33.81 59.61,25.16 48.74,34.77 37.39,31.19 37.15,25.8 35.4,69.53 45.01,63.74 44.45,59.21 43.5,56.67 90.25,72.47 85.33,72.39 103.35,50.56 110.25,50.56 53.34,37.47 54.77,26.75 58.18,18.18 59.05,21.59 55.24,21.59 60.09,28.81 110.49,33.66 126.6,43.02 126.68,36.67 137.08,31.27 148.51,58.34 157.08,59.93 99.85,13.18 124.46,49.85 113.03,78.42 113.51,73.5 120.65,76.36 121.92,79.53 124.46,79.85 136.68,77.95 136.84,70.33 116.68,79.85 119.38,78.74 40.96,28.73 10.32,45.56 10.48,48.58 10.32,50.8 10.16,53.34 10.32,56.2 10.32,58.42 40.64,82.71 46.51,79.69 61.59,74.61 65.88,74.77 72.71,69.22 71.6,77.95 71.44,79.85 68.9,79.85 66.52,79.85 63.98,79.85 61.28,79.85 88.11,79.38 102.08,71.28 111.76,73.5 119.54,73.34 124.46,73.5 128.91,74.61 130.02,66.83 127.95,58.1 119.7,57.15 122.24,56.99 110.81,57.31 115.25,57.31 74.93,55.72 72.39,55.4 72.71,58.9 70.64,58.9 53.18,63.82 33.02,75.41 116.52,50.8 121.76,50.8 127.79,50.64 124.62,44.61 124.78,33.81 98.42,65.41 113.03,66.36 118.43,65.41 130.18,60.48 120.81,65.56 110.17,68.58 54.45,62.55 95.25,77.15 93.03,74.61 117.63,8.73 87.79,66.67 94.3,67.31 42.86,66.83 101.6,27.62 77.95,14.13 77.95,24.13 60.01,15.72 62.87,10.79
  pour Top: 160.02,0 160.02,85.09 0,85.09 0,0
  pour Bottom: 0,0 160.02,0 160.02,85.09 0,85.09
HALT
  Top 0.203: IC2.17 IC1.17
IDE_CS0  (via drill 0.3)
  Top 0.203: IC8.39 118.43,20.32 118.11,20 118.11,12.38 118.11,9.53 118.43,9.21 120.33,9.21 120.65,8.89 124.94,8.89 125.57,9.53 v125.57,9.84
  Bottom 0.203: v125.57,9.84 153.35,9.84 153.67,9.53 CON1.37 154.62,8.89 154.94,8.57 154.94,5.24 154.62,4.92 153.99,4.92 153.67,4.6 R27.1
IDE_CS1  (via drill 0.3)
  Top 0.203: IC8.38 116.84,21.91 117.16,21.59 120.33,21.59 120.65,21.27 120.65,20.32 v120.65,12.7
  Bottom 0.203: R28.1 156.21,4.6 156.53,4.92 157,4.92 157.32,5.24 157.32,8.57 157,8.89 CON1.38 156.21,10 155.89,10.32 152.4,10.32 152.24,10.48 125.09,10.48 120.97,10.48 120.65,10.79 v120.65,12.7
IDE_DIR  (via drill 0.3)